# Altium schematic sheet benchtopsch.SchDoc
size A; SheetNumber: 1; SheetTotal: 2
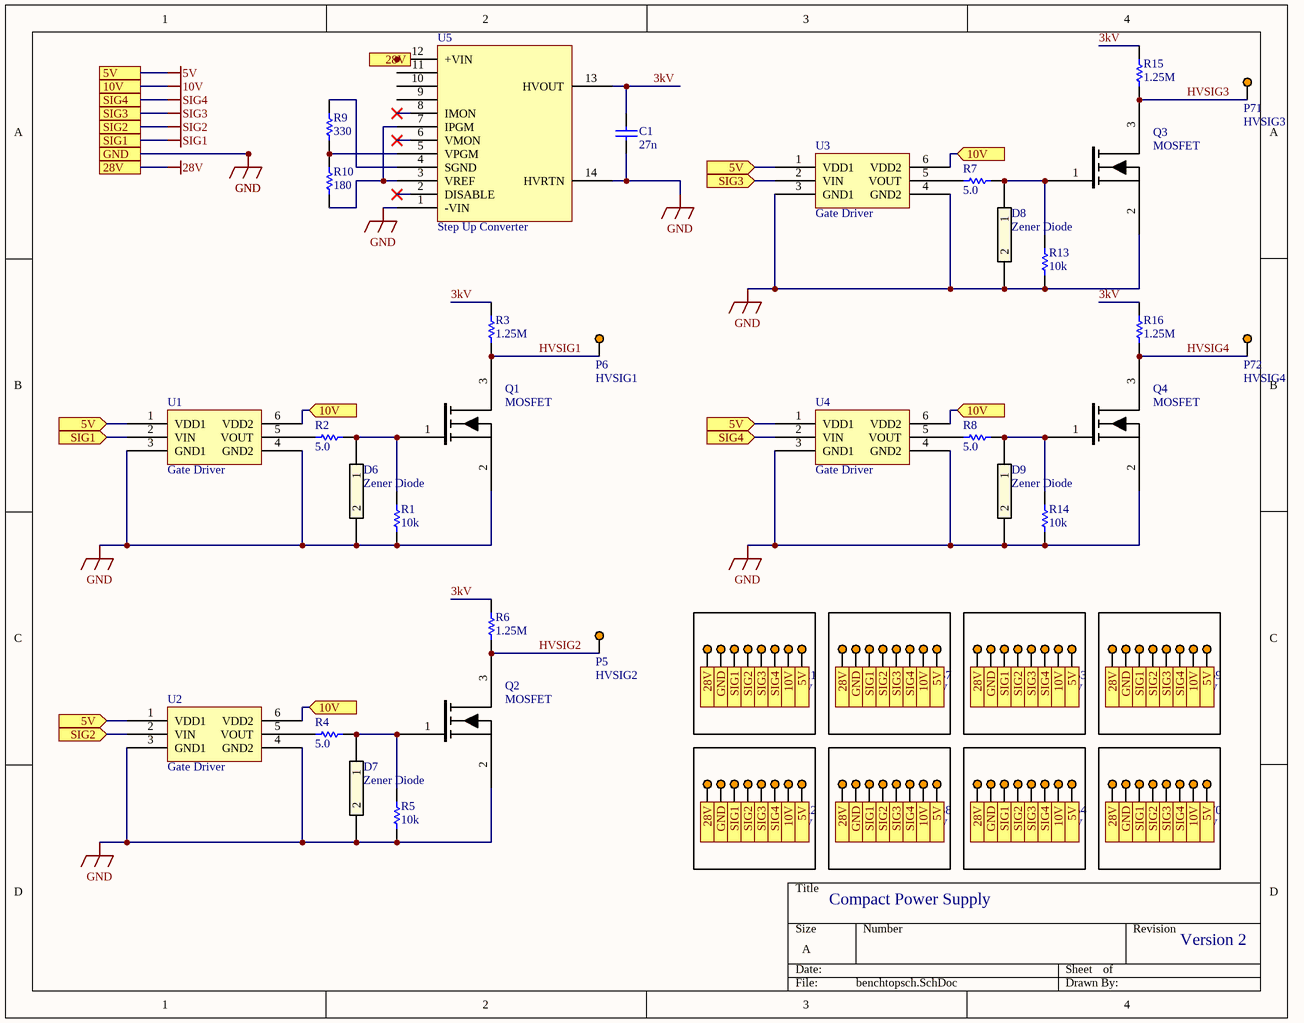
[diagram p0: benchtopsch.SchDoc]

## Parts
C1  27n  [HV Capacitor]
D6  Zener Diode  [Zener Diode]
D7  Zener Diode  [Zener Diode]
D8  Zener Diode  [Zener Diode]
D9  Zener Diode  [Zener Diode]
P5  HVSIG2  [Via]
P6  HVSIG1  [Via]
P7  28V  [Via]
P8  28V  [Via]
P9  GND  [Via]
P10  GND  [Via]
P11  SIG1  [Via]
P12  SIG1  [Via]
P13  SIG2  [Via]
P14  SIG2  [Via]
P15  SIG3  [Via]
P16  SIG3  [Via]
P17  SIG4  [Via]
P18  SIG4  [Via]
P19  20V  [Via]
P20  20V  [Via]
P21  5V  [Via]
P22  5V  [Via]
P23  28V  [Via]
P24  28V  [Via]
P25  GND  [Via]
P26  GND  [Via]
P27  SIG1  [Via]
P28  SIG1  [Via]
P29  SIG2  [Via]
P30  SIG2  [Via]
P31  SIG3  [Via]
P32  SIG3  [Via]
P33  SIG4  [Via]
P34  SIG4  [Via]
P35  20V  [Via]
P36  20V  [Via]
P37  5V  [Via]
P38  5V  [Via]
P39  28V  [Via]
P40  28V  [Via]
P41  GND  [Via]
P42  GND  [Via]
P43  SIG1  [Via]
P44  SIG1  [Via]
P45  SIG2  [Via]
P46  SIG2  [Via]
P47  SIG3  [Via]
P48  SIG3  [Via]
P49  SIG4  [Via]
P50  SIG4  [Via]
P51  20V  [Via]
P52  20V  [Via]
P53  5V  [Via]
P54  5V  [Via]
P55  28V  [Via]
P56  28V  [Via]
P57  GND  [Via]
P58  GND  [Via]
P59  SIG1  [Via]
P60  SIG1  [Via]
P61  SIG2  [Via]
P62  SIG2  [Via]
P63  SIG3  [Via]
P64  SIG3  [Via]
P65  SIG4  [Via]
P66  SIG4  [Via]
P67  20V  [Via]
P68  20V  [Via]
P69  5V  [Via]
P70  5V  [Via]
P71  HVSIG3  [Via]
P72  HVSIG4  [Via]
Q1  MOSFET  [MOSFET]
Q2  MOSFET  [MOSFET]
Q3  MOSFET  [MOSFET]
Q4  MOSFET  [MOSFET]
R1  10k  [LV Resistor]
R2  5.0  [Zener Resistor]
R3  1.25M  [LV Resistor]
R4  5.0  [Zener Resistor]
R5  10k  [LV Resistor]
R6  1.25M  [LV Resistor]
R7  5.0  [Zener Resistor]
R8  5.0  [Zener Resistor]
R9  330  [LV Resistor]
R10  180  [LV Resistor]
R13  10k  [LV Resistor]
R14  10k  [LV Resistor]
R15  1.25M  [LV Resistor]
R16  1.25M  [LV Resistor]
U1  Gate Driver  [Gate Driver]
U2  Gate Driver  [Gate Driver]
U3  Gate Driver  [Gate Driver]
U4  Gate Driver  [Gate Driver]
U5  Step Up Converter  [Step Up Converter]

## Ports
5V, 5V (in), 10V, 10V (in), 28V, GND, SIG1, SIG1 (in), SIG2, SIG2 (in), SIG3, SIG3 (in), SIG4, SIG4 (in)

## Nets
5V: U1.1(VDD1) U2.1(VDD1) U3.1(VDD1) U4.1(VDD1) ; port 5V
10V: U1.6(VDD2) U2.6(VDD2) U3.6(VDD2) U4.6(VDD2) ; port 10V
28V: port 28V
GND: C1.1 D6.2 D7.2 D8.2 D9.2 Q1.2(S) Q2.2(S) Q3.2(S) Q4.2(S) R1.1 R5.1 R13.1 R14.1 U1.3(GND1) U1.4(GND2) U2.3(GND1) U2.4(GND2) U3.3(GND1) U3.4(GND2) U4.3(GND1) U4.4(GND2) U5.1(-VIN) U5.14(HVRTN) ; port GND
SIG1: U1.2(VIN) ; port SIG1
SIG2: U2.2(VIN) ; port SIG2
SIG3: U3.2(VIN) ; port SIG3
SIG4: U4.2(VIN) ; port SIG4
3kV: C1.2 R3.1 R6.1 R15.1 R16.1 U5.13(HVOUT)
HVSIG1: Q1.3(D) R3.2
HVSIG2: Q2.3(D) R6.2
HVSIG3: Q3.3(D) R15.2
HVSIG4: Q4.3(D) R16.2
NetD6_1: D6.1 Q1.1(G) R1.2 R2.1
NetD7_1: D7.1 Q2.1(G) R4.1 R5.2
NetD8_1: D8.1 Q3.1(G) R7.1 R13.2
NetD9_1: D9.1 Q4.1(G) R8.1 R14.2
NetR2_2: R2.2 U1.5(VOUT)
NetR4_2: R4.2 U2.5(VOUT)
NetR7_2: R7.2 U3.5(VOUT)
NetR8_2: R8.2 U4.5(VOUT)
NetR9_1: R9.1 U5.4(SGND)
NetR9_2: R9.2 R10.1 U5.5(VPGM)
NetR10_2: R10.2 U5.3(VREF) U5.7(IPGM)

Not connected (* = marked no-connect by the designer): P5 1; P6 1; P7 1; P8 1; P9 1; P10 1; P11 1; P12 1; P13 1; P14 1; P15 1; P16 1; P17 1; P18 1; P19 1; P20 1; P21 1; P22 1; P23 1; P24 1; P25 1; P26 1; P27 1; P28 1; P29 1; P30 1; P31 1; P32 1; P33 1; P34 1; P35 1; P36 1; P37 1; P38 1; P39 1; P40 1; P41 1; P42 1; P43 1; P44 1; P45 1; P46 1; P47 1; P48 1; P49 1; P50 1; P51 1; P52 1; P53 1; P54 1; P55 1; P56 1; P57 1; P58 1; P59 1; P60 1; P61 1; P62 1; P63 1; P64 1; P65 1; P66 1; P67 1; P68 1; P69 1; P70 1; P71 1; P72 1; U5 2(DISABLE)* 6(VMON)* 8(IMON)* 9 10 11 12(+VIN)

## Notes on the sheet
- Compact Power Supply
- Version 2

## Library data of the parts
C1 = Capacitor
D6-D9 = Zener Diode: KDZVTR16B; Vendor: ROHM Semiconductor; Built_By: EMA_Matt; SourceLibrary: Rohm_2019-09-23; Type: DEV; Manufacturer_Part_Number: KDZVTR16B; Copyright: Copyright (C) 2018 Accelerated Designs. All rights reserved; RefDes: RefDes
P5-P72 = Output Point: Thru hole via
Q1-Q4 = MOSFET: IXTL2N4X0
R1-R10 R13-R16 = Resistor
U1-U4 = Gate Driver: ADuM4120
U5 = Step Up Converter: HRL30